# Altium schematic sheet Alim.SchDoc
size A4; Author: Fürst Nicolas; CompanyName: ETML-ES; Address1: Avenue Rencordon 1; Address2: 1004 Lausanne; Address3: Suisse; SheetNumber: 2; SheetTotal: 2
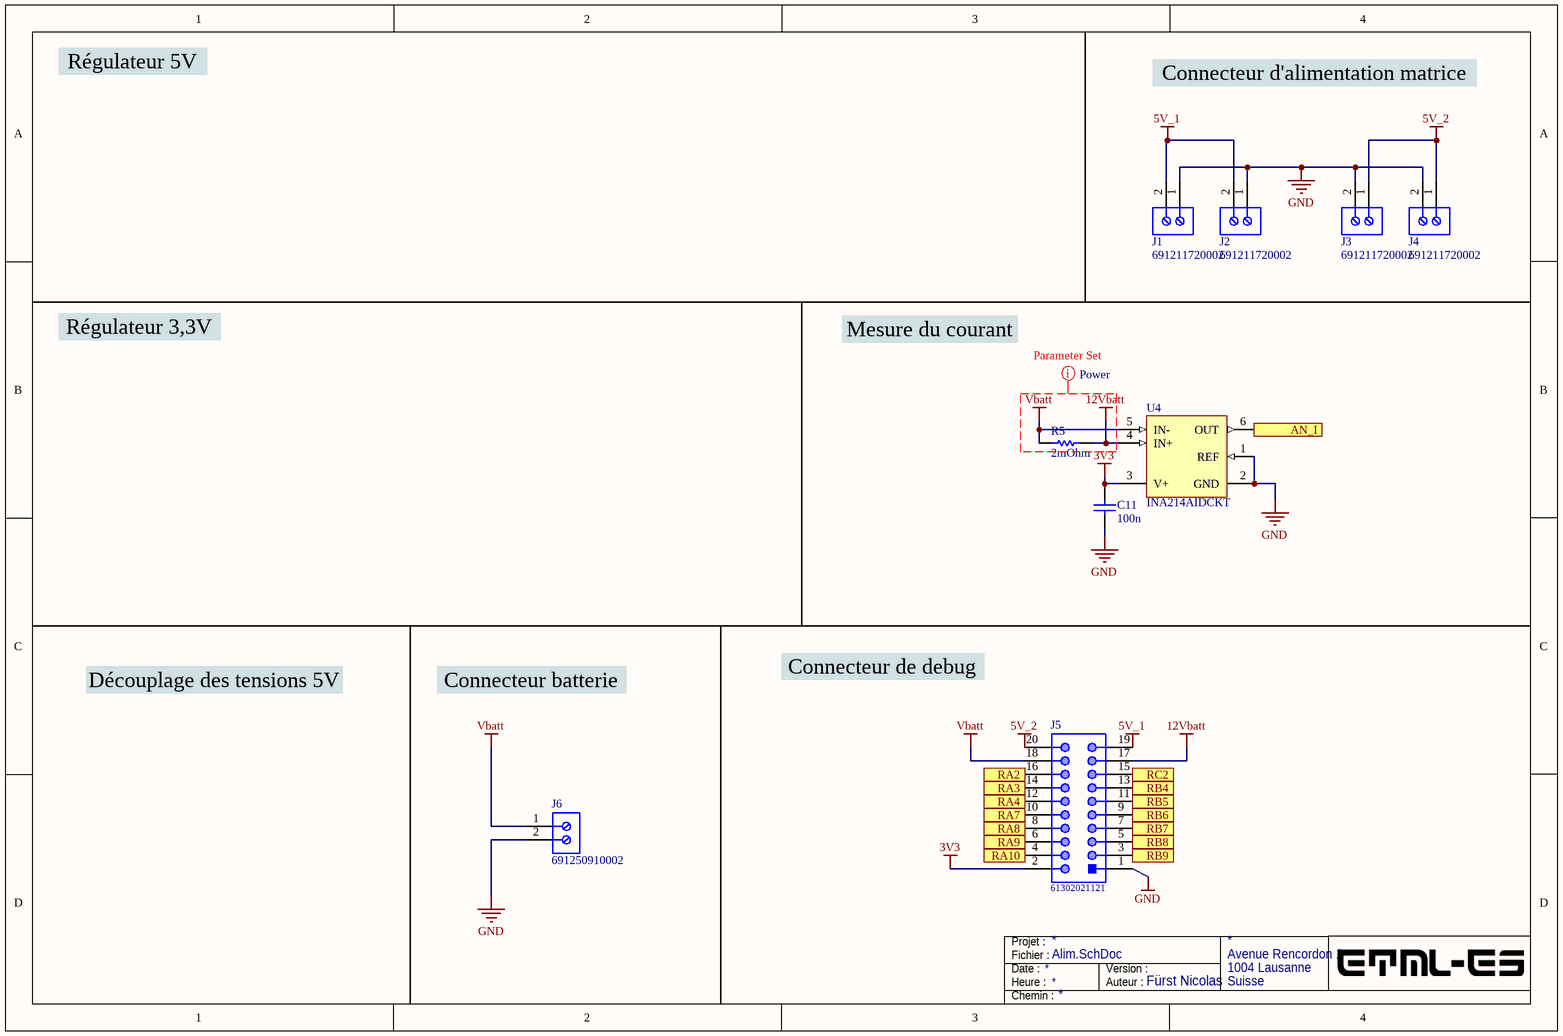
[diagram p0: Alim.SchDoc]

## Parts
C11  100n  [CAPC0805(2012)155_L]
J1  691211720002  [691211720002]
J2  691211720002  [691211720002]
J3  691211720002  [691211720002]
J4  691211720002  [691211720002]
J5  61302021121  [61302021121]
J6  691250910002  [691250910002]
R5  2mOhm  [RESC1206(3216)_N]
U4  INA214AIDCKT  [DCK0006A_N]

## Ports
AN_I, RA2, RA3, RA4, RA7, RA8, RA9, RA10, RB4, RB5, RB6, RB7, RB8, RB9, RC2

## Nets
3V3: C11.1 J5.2 U4.3(V+)
5V_1: J1.2 J2.2 J5.19
5V_2: J3.1 J4.1 J5.20
12Vbatt: J5.17 R5.1 U4.4(IN+)
GND: C11.2 J1.1 J2.1 J3.2 J4.2 J5.1 J6.2 U4.1(REF) U4.2(GND)
Vbatt: J5.18 J6.1 R5.2 U4.5(IN-)
AN_I: U4.6(OUT) ; port AN_I
RA2: J5.16 ; port RA2
RA3: J5.14 ; port RA3
RA4: J5.12 ; port RA4
RA7: J5.10 ; port RA7
RA8: J5.8 ; port RA8
RA9: J5.6 ; port RA9
RA10: J5.4 ; port RA10
RB4: J5.13 ; port RB4
RB5: J5.11 ; port RB5
RB6: J5.9 ; port RB6
RB7: J5.7 ; port RB7
RB8: J5.5 ; port RB8
RB9: J5.3 ; port RB9
RC2: J5.15 ; port RC2

## Layout directives
net class Power: 12Vbatt, Vbatt

## Notes on the sheet
- Régulateur 5V
- Connecteur d'alimentation matrice
- Régulateur 3,3V
- Mesure du courant
- Découplage des tensions 5V
- Connecteur batterie
- Connecteur de debug
- Fichier :
- Date :
- Heure :
- Projet :
- Auteur :
- Version :
- Chemin :

## Library data of the parts
C11 = Capa: Case-EIA: 0805; Rated Voltage: 10 V; Value: 4.7uF; Tolerance: Â±10%; Case-Metric: 2012; Max Thickness: 1.55 mm; Technology: SMT
J1-J4 = CMP-1502-02524-1: Serie 211 - 5.00 mm 45deg Entry Modular with Rising Cage Clamp - 15.50 mm Height WR-TBL, 2 pin; Manufacturer: Wurth Elektronik; Pitch: 5.00mm; Pin Number: 2; Manufacturer URL: http://www.we-online.de; Mounting Technology: THT; Packaging: Box; Datasheet URL: http://katalog.we-online.de/em/datasheet/6912117200xx.pdf; Operating Temperature: -40to105degC; Package Reference: 691211720002; Part Number: 691211720002; Publisher: WurthElektronik
J5 = CMP-1502-01104-1: THT Vertical Pin Header WR-PHD, Pitch 2.54 mm, Dual Row, 20 pins; Manufacturer: Wurth Elektronik; Pin Number: 20; Withstanding Voltage: 500VAC; Contact Resistance: 20mOhm; Gender: Male; Working Voltage: 250VAC; Pitch: 2.54mm; Rated Current: 3A; Datasheet URL: https://katalog.we-online.de/em/datasheet/6130xx21121.pdf; Mounting Technology: THT; Package Reference: 61302021121; Manufacturer URL: http://www.we-online.de; Part Number: 61302021121; Orientation: Vertical; Operating Temperature: -40to105degC; Row Number: Dual; Publisher: WurthElektronik; Packaging: Bag
J6 = CMP-1502-02750-1: Serie 2509 - 9.52 mm Horizontal Entry Modular with Rising Cage Clamp WR-TBL, 2 pin; Manufacturer: Wurth Elektronik; Pin Number: 2; Pitch: 9.52mm; Datasheet URL: http://katalog.we-online.de/em/datasheet/6912509100XX.pdf; Mounting Technology: THT; Package Reference: 691250910002; Publisher: WurthElektronik; Packaging: Box; Manufacturer URL: http://www.we-online.de; Operating Temperature: -30to120degC; Part Number: 691250910002
R5 = Resistor: Value: 1000000.00 Ohm; Case-Metric: 2012; Case-EIA: 0805; Power: 0.125 W; Tolerance: 1 %; Technology: SMT
U4 = CMP-2000-06456-1: Voltage Output, High / Low-Side Measurement, Bi-Directional Zero-Drift Series, Current Shunt Monitor, 2.7 to 26 V, -40 to 125 degC, 6-Pin SOT-23 (DCK6), Green (RoHS & no Sb/Br), Tape and Reel; Package Version: 4093553-4/G, 01/2007; Development Kit: INA210-214EVM; Unit Weight: 0.000088oz; Vcm - Common Mode Voltage: -0.3Vto+26V; Gain V/V: 100V/V; Operating Supply Current: 115uA; Topology: CurrentShuntFeedback; Number of Channels: 1Channel; Accuracy: 1%; Amplifier Type: CurrentSense; Gain Error: 0.02%; Vos - Input Offset Voltage: 60uV; Brand: TexasInstruments; Supply Voltage - Max: 26V; CMRR - Common Mode Rejection Ratio: 105dB; Supply Voltage - Min: 2.7V; GBP - Gain Bandwidth Product: 30kHz; Product Category: CurrentSenseAmplifiers; Series: INA214; Mounting Style: SMD/SMT; Datasheet URL: http://www.ti.com/lit/gpn/INA214?keyMatch=INA214AIDCKT&tisearch=Search-EN-Everything; Maximum Operating Temperature: +125C; Package / Case: SOT-23-6; Minimum Operating Temperature: -40C; Datasheet Version: Rev. G, 07/2014; RoHS: True; Manufacturer URL: http://www.ti.com/; Package Description: 6-Pin Plastic Small Outline, Body 2 x 1.25 mm, Pitch 0.65 mm; Product: CurrentSenseAmplifiers; Package Reference: DCK6; Packaging: Reel; Manufacturer: TexasInstruments; Mounting Technology: SurfaceMount